# Altium schematic sheet PWM Generation.SchDoc
size A; SheetNumber: 5; SheetTotal: 5
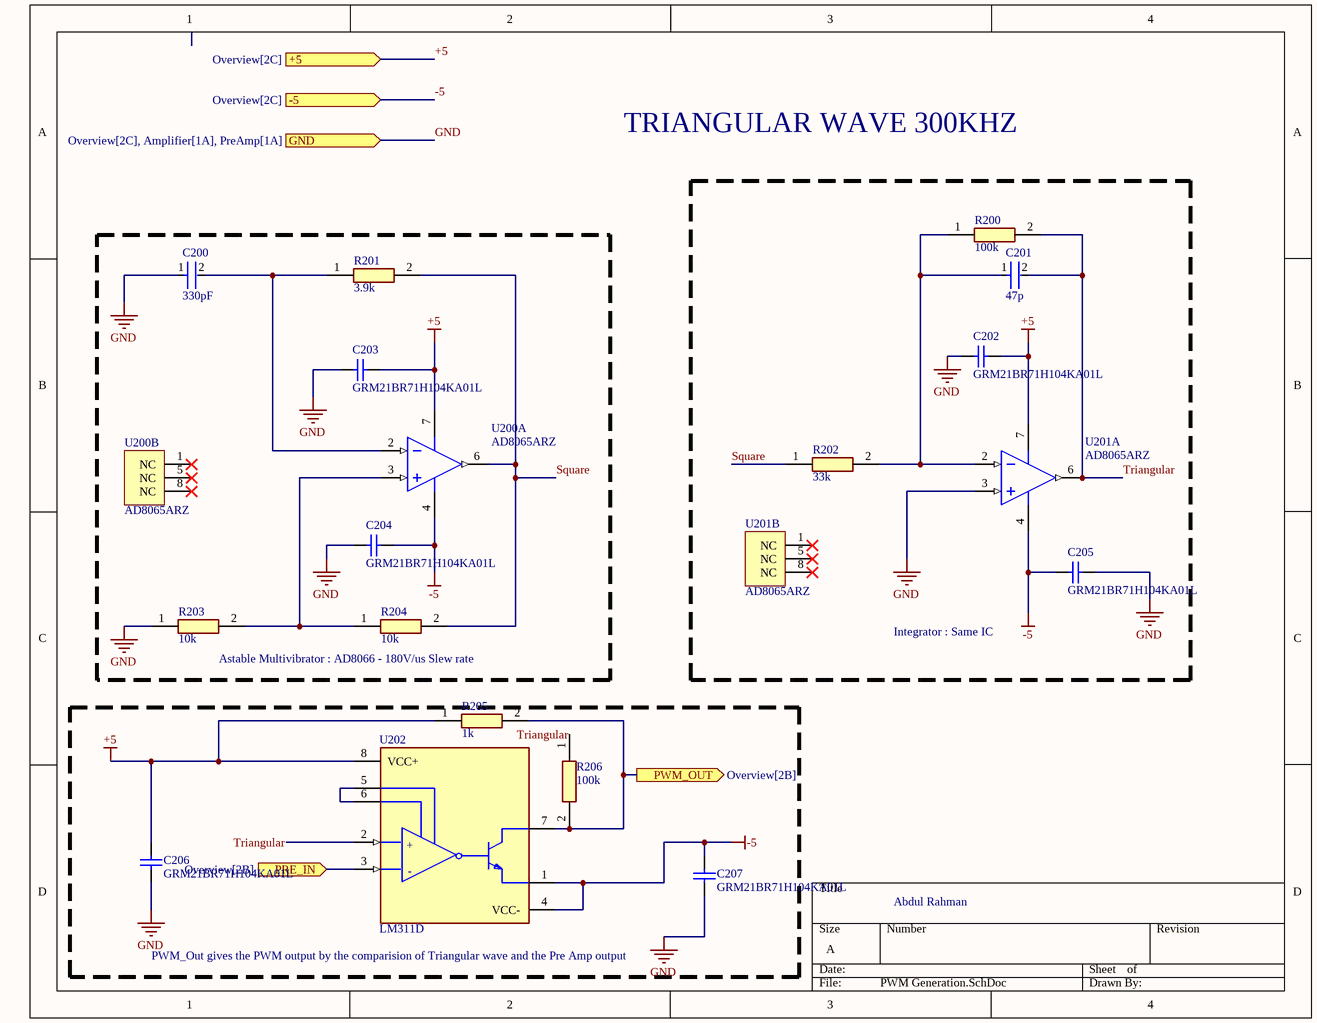
[diagram p0: PWM Generation.SchDoc]

## Parts
C200  330pF  [FP-RCE1K1-3_15-MFG]
C201  47p  [FP-RCE1K1-3_15-MFG]
C202  GRM21BR71H104KA01L  [CAPC2013X135X45ML10T25]
C203  GRM21BR71H104KA01L  [CAPC2013X135X45ML10T25]
C204  GRM21BR71H104KA01L  [CAPC2013X135X45ML10T25]
C205  GRM21BR71H104KA01L  [CAPC2013X135X45ML10T25]
C206  GRM21BR71H104KA01L  [CAPC2013X135X45ML10T25]
C207  GRM21BR71H104KA01L  [CAPC2013X135X45ML10T25]
R200  100k  [RESAD1650W60L650D250]
R201  3.9k  [RESAD1650W60L650D250]
R202  33k  [RESAD1650W60L650D250]
R203  10k  [RESAD1650W60L650D250]
R204  10k  [RESAD1650W60L650D250]
R205  1k  [RESAD1650W60L650D250]
R206  100k  [RESAD1650W60L650D250]
U200  AD8065ARZ  [ADI-R-8_N]  (parts A,B of 2)
U201  AD8065ARZ  [ADI-R-8_N]  (parts A,B of 2)
U202  LM311D  [FP-D0008A-MFG]

## Blocks framed on the sheet
Integrator : Same IC: C201 C202 C205 R200 R202 U201
Astable Multivibrator : AD8066 - 180V/us Slew rate: C200 C203 C204 R201 R203 R204 U200

## Ports
+5 (in, see Overview[2C]), -5 (in, see Overview[2C]), GND (in, see Overview[2C], Amplifier[1A], PreAmp[1A]), PRE_IN (in, see Overview[2B]), PWM_OUT (out, see Overview[2B])

## Nets
+5: C202.1 C203.1 C206.2 R205.1 U200.7(+VS) U201.7(+VS) U202.8(VCC+) ; port +5
-5: C204.1 C205.2 C207.2 U200.4(-VS) U201.4(-VS) U202.1(EMIT_OUT) U202.4(VCC-) ; port -5
GND: C200.1 C202.2 C203.2 C204.2 C205.1 C206.1 C207.1 R203.1 U201.3(+IN) ; port GND
PRE_IN: U202.3(IN-) ; port PRE_IN
PWM_OUT: R205.2 R206.2 U202.7(COL_OUT) ; port PWM_OUT
Square: R201.2 R202.1 R204.2 U200.6(VOUT)
Triangular: C201.2 R200.2 R206.1 U201.6(VOUT) U202.2(IN+)
NetC200_2: C200.2 R201.1 U200.2(-IN)
NetC201_1: C201.1 R200.1 R202.2 U201.2(-IN)
NetR203_2: R203.2 R204.1 U200.3(+IN)
NetU202_5: U202.5(BALANCE) U202.6(BAL/STRB)

Not connected (* = marked no-connect by the designer): U200 1(NC)* 5(NC)* 8(NC)*; U201 1(NC)* 5(NC)* 8(NC)*

## Notes on the sheet
- TRIANGULAR WAVE 300KHZ
- Abdul Rahman
- (near U202) PWM_Out gives the PWM output by the comparision of Triangular wave and the Pre Amp output
- (in symbol CMP-04896-000022-1) +; -

## Library data of the parts
C200 C201 = CMP-06035-025793-1: Capacitor
C202-C207 = CMP-2100-03644-1: Chip Capacitor, 0.1 uF, +/- 10%, 50 V, -55 to 125 degC, 0805 (2012 Metric), RoHS, Tape and Reel; Manufacturer: Murata; Voltage: 50V; Capacitance: 100nF; Insulation Resistance: 10GR; Dielectric Material: Ceramic; Dielectric: X7R; Package Description: 2-Pin Surface Mount Device, Body 2 x 1.25 mm; Manufacturer URL: http://www.murata.com/; Case Code (Imperial): 0805; Datasheet URL: http://psearch.en.murata.com/capacitor/product/GRM21BR71H104KA01%23.pdf; Termination: SMD/SMT; Lead Free: LeadFree; Package Quantity: 1; Mount: SurfaceMount; REACH SVHC: Unknown; Thickness: 0.053inch; Height: 1.25mm; Case/Package: 0805; Voltage Rating: 50V; Width: 0.049inch; Case Code (Metric): 2012; Material: Ceramic; Min Operating Temperature: -55degC; RoHSCompliant: true; Datasheet Version: 42675.0; Voltage Rating (DC): 50V; Tolerance: 10%; Package Reference: 0805; Depth: 1.25mm; Length: 2mm; Max Operating Temperature: 125degC; Packaging: TapeandReel; Number of Pins: 2; Radiation Hardening: No
R200-R206 = PR01000101001JR500: Resistor; Manufacturer_Name: Vishay; Datasheet Link: https://componentsearchengine.com/Datasheets/2/PR01000101001JR500.pdf; Manufacturer_Part_Number: PR01000101001JR500; Mouser Part Number: 594-5073NW1K000J; Mouser Price/Stock: https://www.mouser.co.uk/ProductDetail/Vishay-BC-Components/PR01000101001JR500?qs=LCMWAU1DZcz1DDPbu%2F9jJQ%3D%3D; Arrow Part Number: PR01000101001JR500; Arrow Price/Stock: https://www.arrow.com/en/products/pr01000101001jr500/vishay?region=nac
U200 U201 = CMP-0384-01216-2: Single Channel Low Power Operational Amplifier, 145 MHz BW, 180 V/us SR, Industrial, 8-pin SOIC (R-8), Tube; Manufacturer: Analog Devices; Generic Part Number: AD8065; V Span Max: 24V; Iq/Amp: 7.4mA; V Span Min: 5V; Input Bias Current: 2pA; Automotive Qualified: Yes; Input Offset Voltage: 400uV; Small Signal Bandwidth: 145MHz; Amplifiers Per Package: 1; PackageDescription: 8-Pin Standard Small Outline Package, Body 3.9 x 4.9 mm, Pitch 1.27 mm; Code_JEDEC: MS-012-AA; ComponentLink2Description: Datasheet; ComponentLink4Description: Reference Circuit; PackageReference: R-8; Slew Rate: 180V/us; PartNumber: AD8065ARZ; ComponentLink1URL: http://www.analog.com/en/index.html; ComponentLink4URL: http://www.analog.com/en/all-operational-amplifiers-op-amps/operational-amplifiers-op-amps/ad8065/products/product.html#product-recommendations; RevisionNote: Reference Circuit URL fixed; ComponentLink1Description: Manufacturer URL; PackageVersion: 060506-A; ComponentLink2URL: http://www.analog.com/static/imported-files/data_sheets/AD8065_8066.pdf; ComponentLink3URL: http://www.analog.com/static/imported-files/packages/PKG_PDF/SOIC_Narrow%20(R)/R_8.pdf; ComponentLink3Description: Package Specification; Mounting Technology: Surface Mount; DatasheetVersion: Rev. J
U202 = CMP-04896-000022-1: IC DIFF COMP W/STROBE 8-SOIC; Manufacturer: Texas Instruments; Standoff Height: 0.11mm; Max Junction Temp: +150°C; Voltage Gain: 200V/mV; Input Offset Voltage: 2mV; Min Supply Voltage: 3.5V; Response Time: 165ns; Max Supply Voltage: 30V; Number Of Channels: 1; Input Bias Current: 0.1uA; Nominal Supply Current: 5.1mA; Automotive: No; Temperature Range High: +70°C; Lead Free: Yes; Ambient Temperature Range Low: 0°C; ComponentLink2URL: http://www.ti.com/lit/ds/symlink/lm311.pdf; Ambient Temperature Range High: +70°C; Manufacturer Part Number: LM311D; Package: D0008A; Temperature Range Low: 0°C; RoHS: TRUE; Digikey Description: IC DIFF COMP W/STROBE 8-SOIC; ComponentLink2Description: Datasheet; Temperature: 0°C to +70°C; Height: 1.75mm; Category: IC; Device Class L1: Integrated Circuits (ICs); Ipc Land Pattern Name: SOIC127P600X175-8; Octopart: https://octopart.com/lm311d-texas+instruments-428348; Device Class L3: Comparators; Mouser Description: Analog Comparators Single Channler; Device Class L2: Linear ICs